# Altium schematic sheet 4_COMMUNICATION.SchDoc
size 420 x 297 mm; SheetNumber: 4; SheetTotal: 7
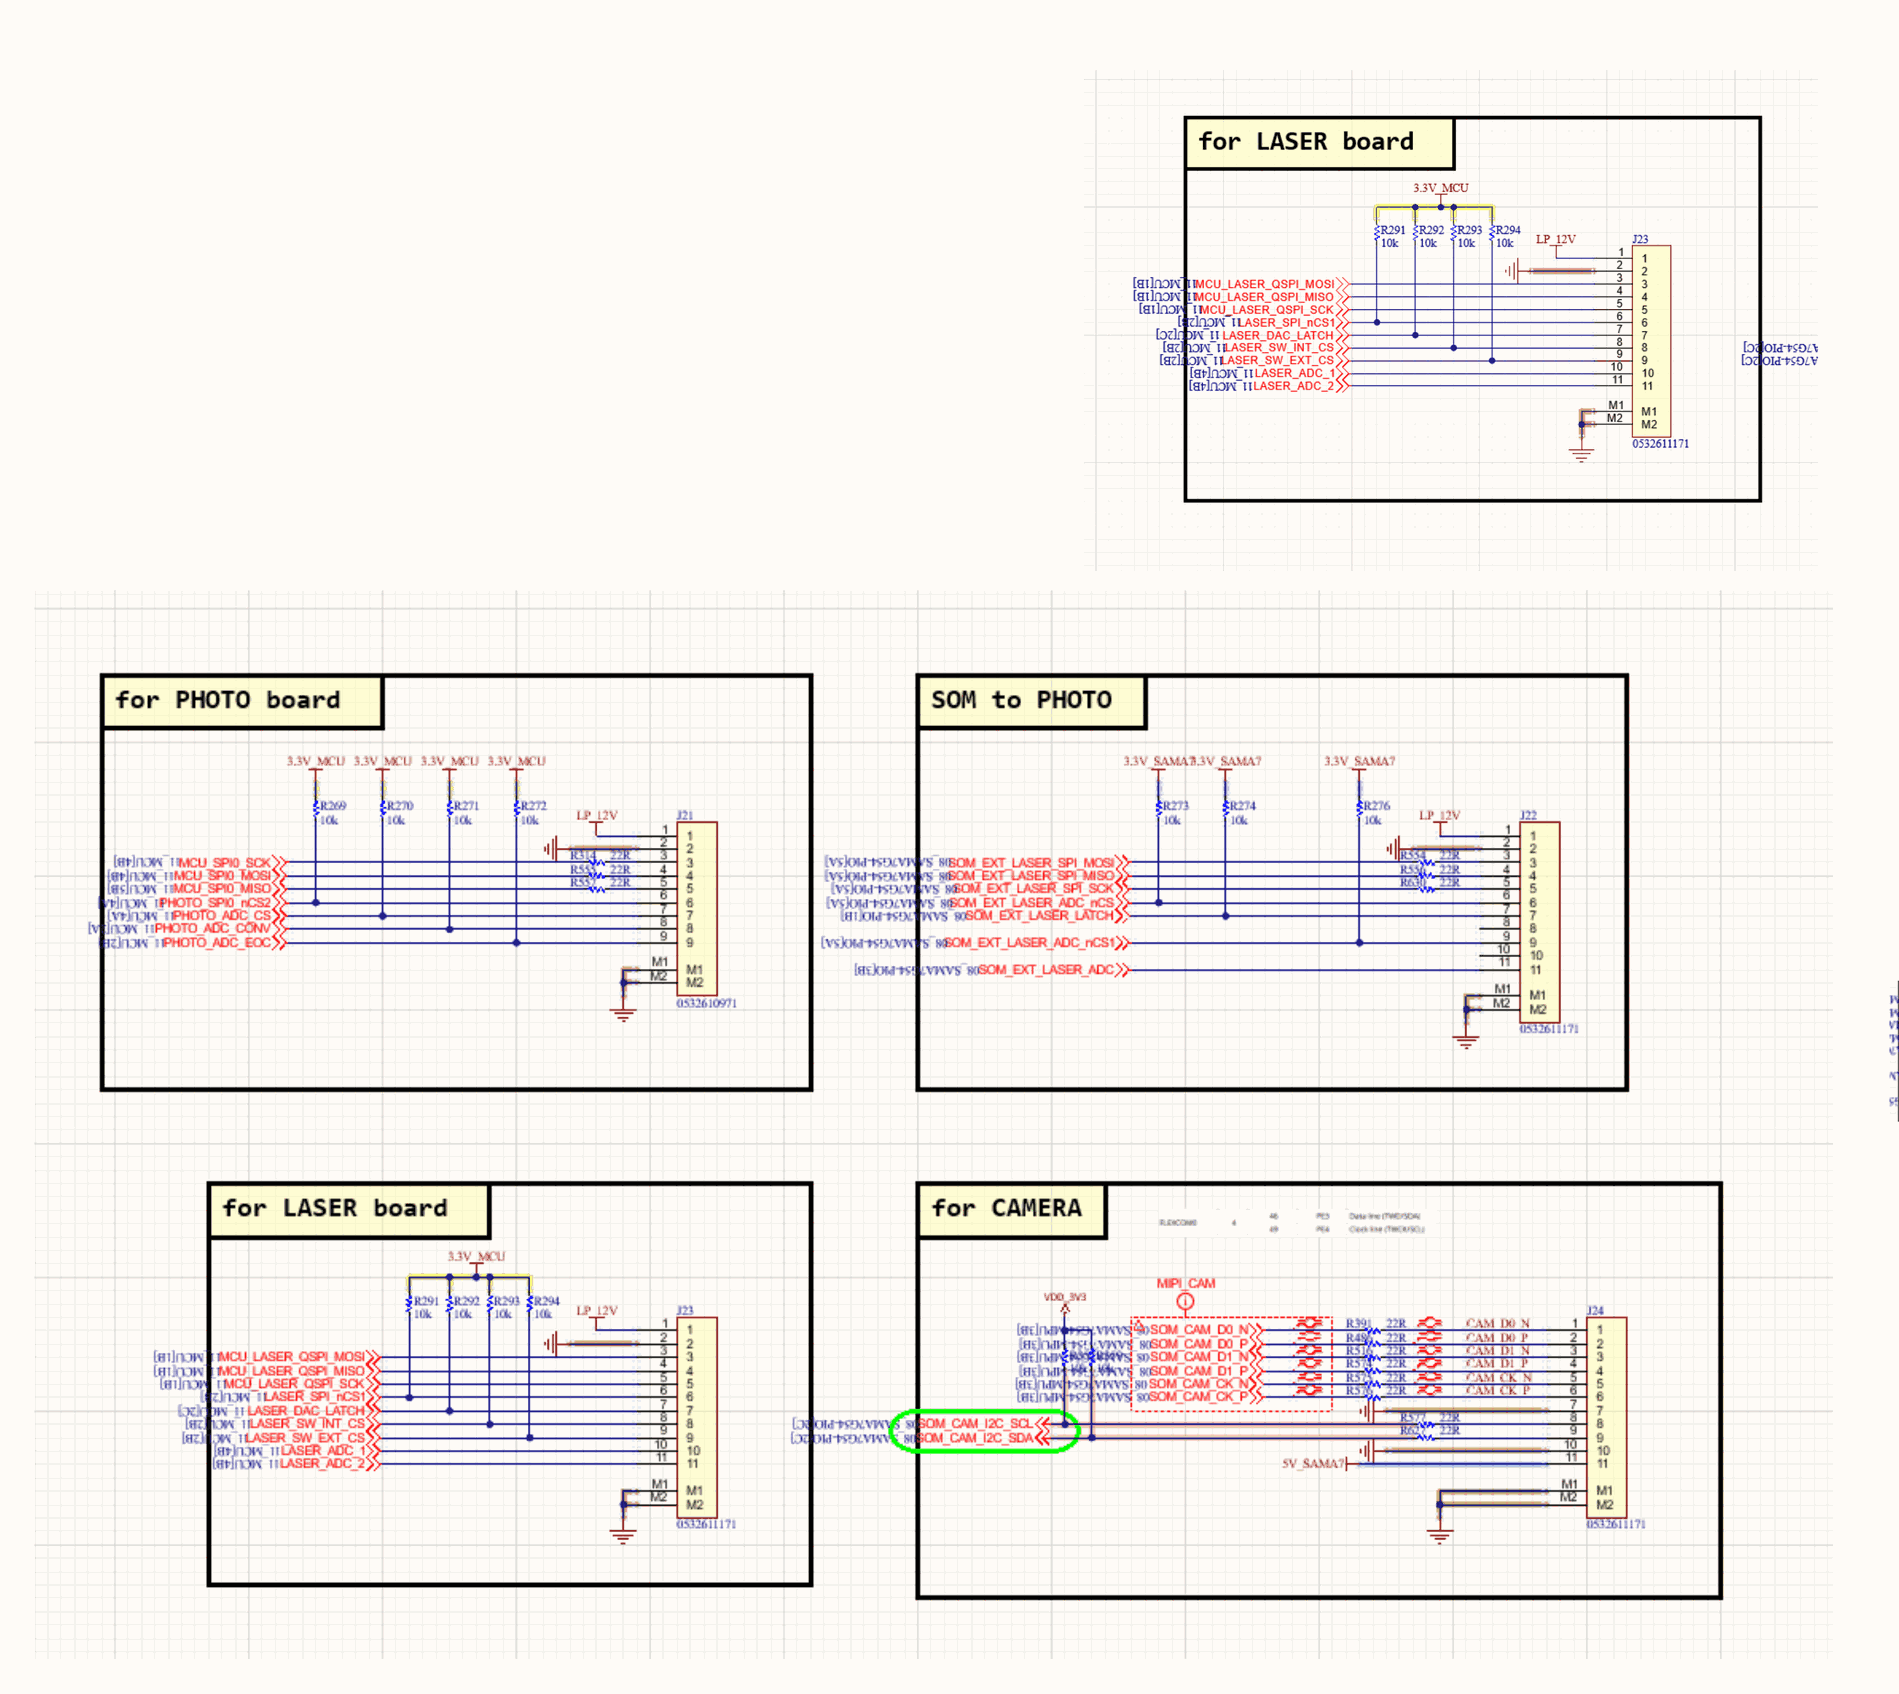
[diagram p0: 4_COMMUNICATION.SchDoc, left]
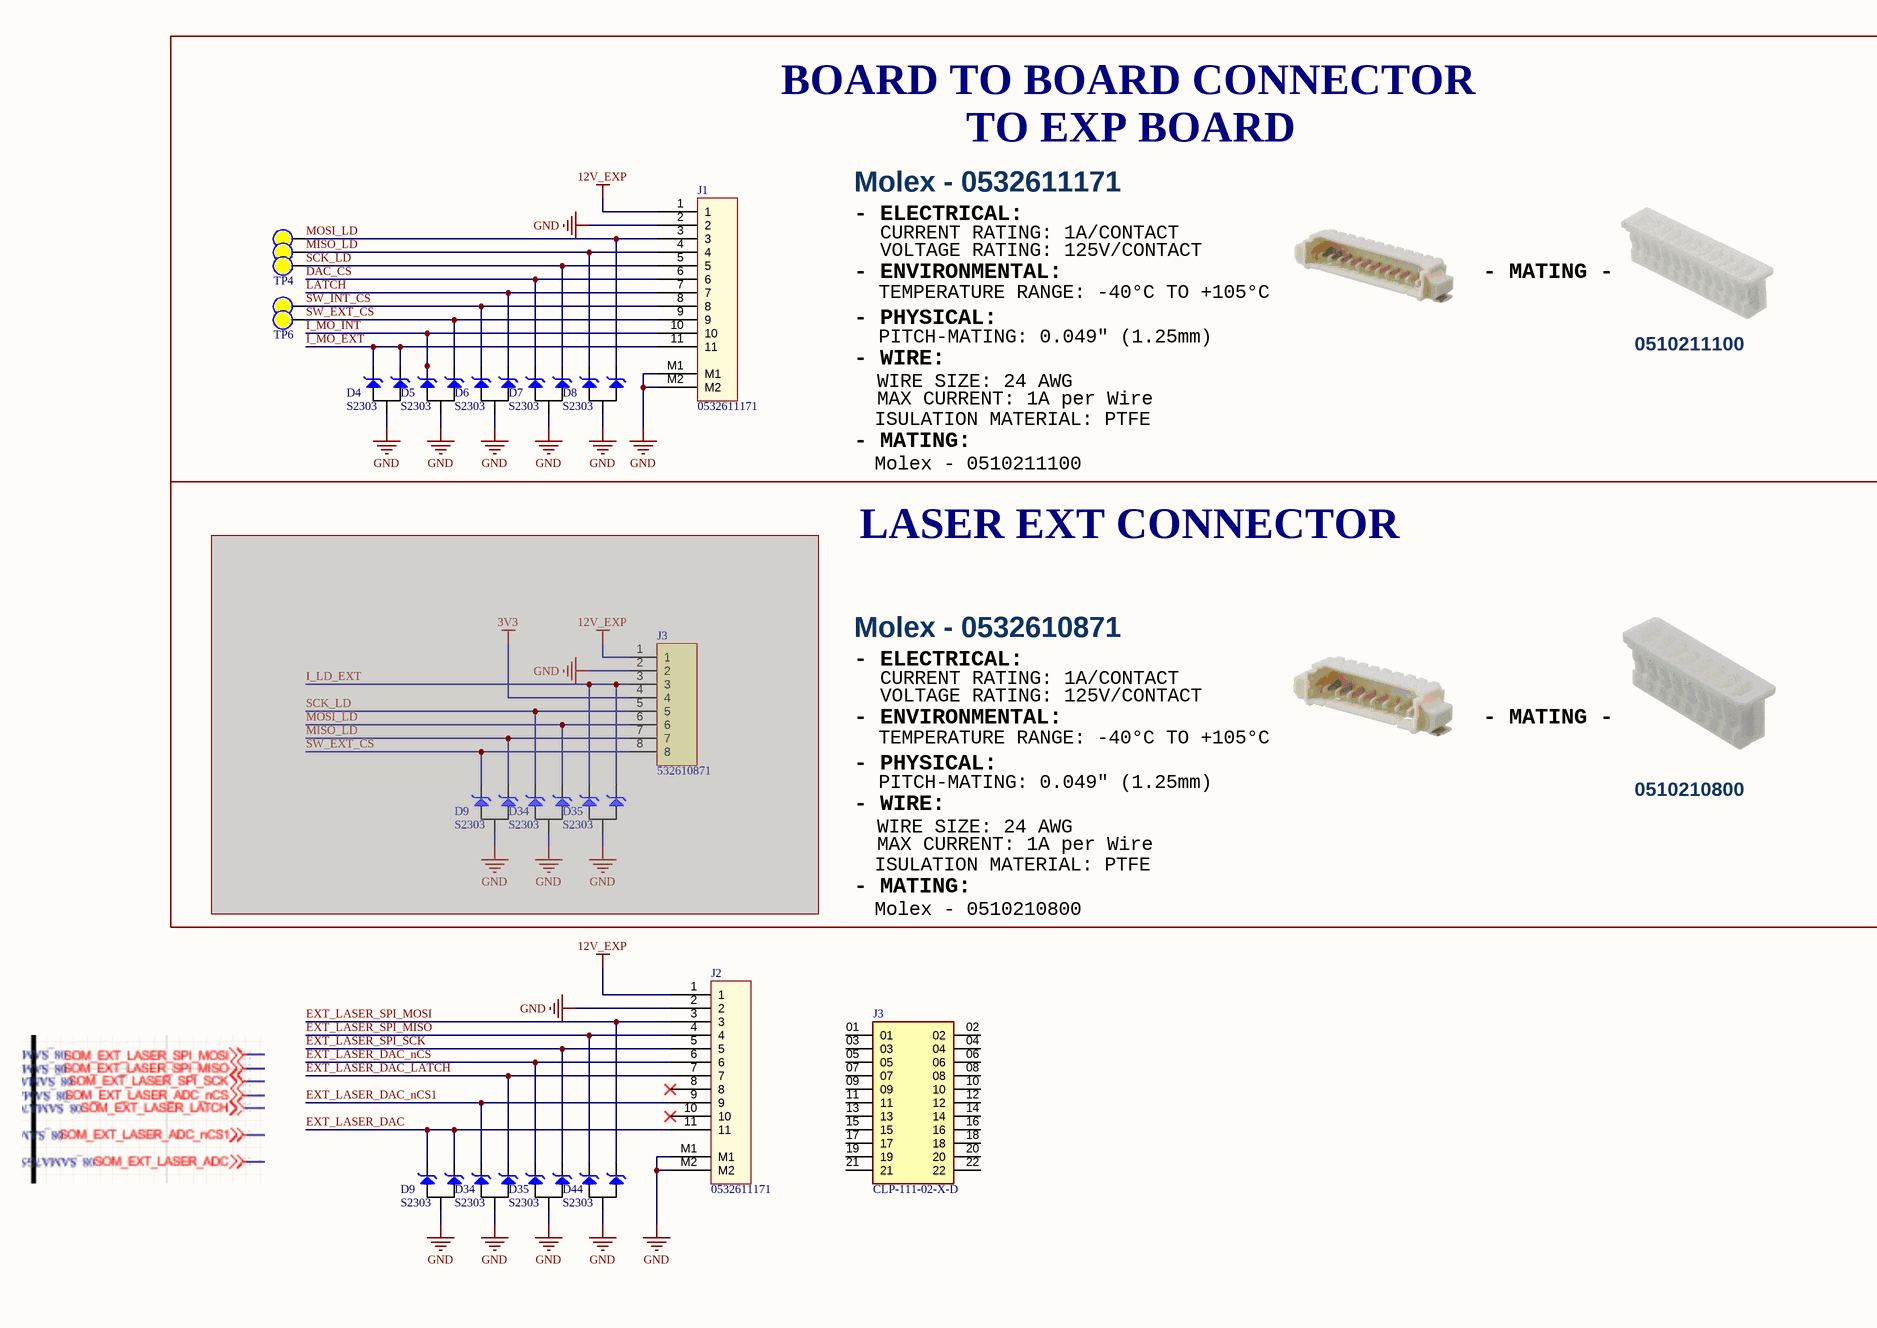
[diagram p1: 4_COMMUNICATION.SchDoc, right]

## Parts
(Parts that share a designator on the sheet are numbered #1, #2 ... from top to bottom, then left to right.)
D4  S2303  [SOT23-3-132]
D5  S2303  [SOT23-3-132]
D6  S2303  [SOT23-3-132]
D7  S2303  [SOT23-3-132]
D8  S2303  [SOT23-3-132]
D9#1  S2303  [SOT23-3-132]  (masked out: inside a compile mask, not in the netlist)
D9#2  S2303  [SOT23-3-132]
D34#1  S2303  [SOT23-3-132]  (masked out: inside a compile mask, not in the netlist)
D34#2  S2303  [SOT23-3-132]
D35#1  S2303  [SOT23-3-132]  (masked out: inside a compile mask, not in the netlist)
D35#2  S2303  [SOT23-3-132]
D44  S2303  [SOT23-3-132]
J1  0532611171  [MOLEX_0532611171]
J2  0532611171  [MOLEX_0532611171]
J3#1  532610871  [MOLEX_0532610871]  (masked out: inside a compile mask, not in the netlist)
J3#2  CLP-111-02-X-D  [SAMTEC_CLP-111-02-X-D]
TP2  (no value)  [Testpoint_50]  (no BOM)
TP3  (no value)  [Testpoint_50]  (no BOM)
TP4  (no value)  [Testpoint_50]  (no BOM)
TP5  (no value)  [Testpoint_50]  (no BOM)
TP6  (no value)  [Testpoint_50]  (no BOM)

## Blocks framed on the sheet
LASER EXT CONNECTOR: D9#1 D34#1 D35#1 J3#1

## Nets
12V_EXP: J1.1 J2.1
GND: D4.3 D5.3 D6.3 D7.3 D8.3 D9#2.3 D34#2.3 D35#2.3 D44.3 J1.2 J1.M1 J1.M2 J2.2 J2.M1 J2.M2
DAC_CS: D7.2 J1.6
EXT_LASER_DAC: D9#2.1 D9#2.2 J2.11
EXT_LASER_DAC_LATCH: D34#2.1 J2.7
EXT_LASER_DAC_nCS: D35#2.2 J2.6
EXT_LASER_DAC_nCS1: D34#2.2 J2.9
EXT_LASER_SPI_MISO: D44.2 J2.4
EXT_LASER_SPI_MOSI: D44.1 J2.3
EXT_LASER_SPI_SCK: D35#2.1 J2.5
I_MO_EXT: D4.1 D4.2 J1.11
I_MO_INT: D5.2 J1.10
LATCH: D6.1 J1.7
MISO_LD: D8.2 J1.4 TP3.1
MOSI_LD: D8.1 J1.3 TP2.1
SCK_LD: D7.1 J1.5 TP4.1
SW_EXT_CS: D5.1 J1.9 TP6.1
SW_INT_CS: D6.2 J1.8 TP5.1

Not connected (* = marked no-connect by the designer): J2 8* 10*; J3#2 01 02 03 04 05 06 07 08 09 10 11 12 13 14 15 16 17 18 19 20 21 22

## Notes on the sheet
- BOARD TO BOARD CONNECTOR
- Molex - 0532611171
- TO EXP BOARD
- - ELECTRICAL:
- CURRENT RATING: 1A/CONTACT
- VOLTAGE RATING: 125V/CONTACT
- - ENVIRONMENTAL:
- - PHYSICAL:
- TEMPERATURE RANGE: -40°C TO +105°C
- - MATING -
- - WIRE:
- WIRE SIZE: 24 AWG
- PITCH-MATING: 0.049" (1.25mm)
- 0510211100
- - MATING:
- ISULATION MATERIAL: PTFE
- Molex - 0510211100
- MAX CURRENT: 1A per Wire
- Molex - 0532610871
- 0510210800
- Molex - 0510210800
- Project:
- Sub-system:
- Design by:
- Sheet title:
- Sheet
- A3
- of
- Checked by:
- Approved by:
- Revision:
- Document No:
- Size:
- Date:

## Library data of the parts
J1 J2 = Header 11x1_2M
J3#1 = 532610871: Manufacturer_Name: Molex Connector Corporation; Copyright: Copyright (C) 2025 Ultra Librarian. All rights reserved.; Manufacturer_Part_Number: 532610871; Datasheet: https://www.molex.com/en-us/products/part-detail-pdf/532610871?display=pdf; RefDes: RefDes; Type: Type
J3#2 = CLP-111-02-X-D: CLP - Samtec 1.27mm Tiger Claw Rugged Reliable Dual Wipe Socket Strip; MP: CLP-111-02-L-D; SnapEDA_Link: https://www.snapeda.com/parts/CLP-111-02-L-D/Samtec/view-part/?ref=snap; Package: None; Value: *; MF: Samtec; Check_prices: https://www.snapeda.com/parts/CLP-111-02-L-D/Samtec/view-part/?ref=eda
TP2-TP6 = Test Point: Solder: NF